# EAGLE design lvc (EAGLE 8.7.0)
DOC_NUM: 1; REVISION: A
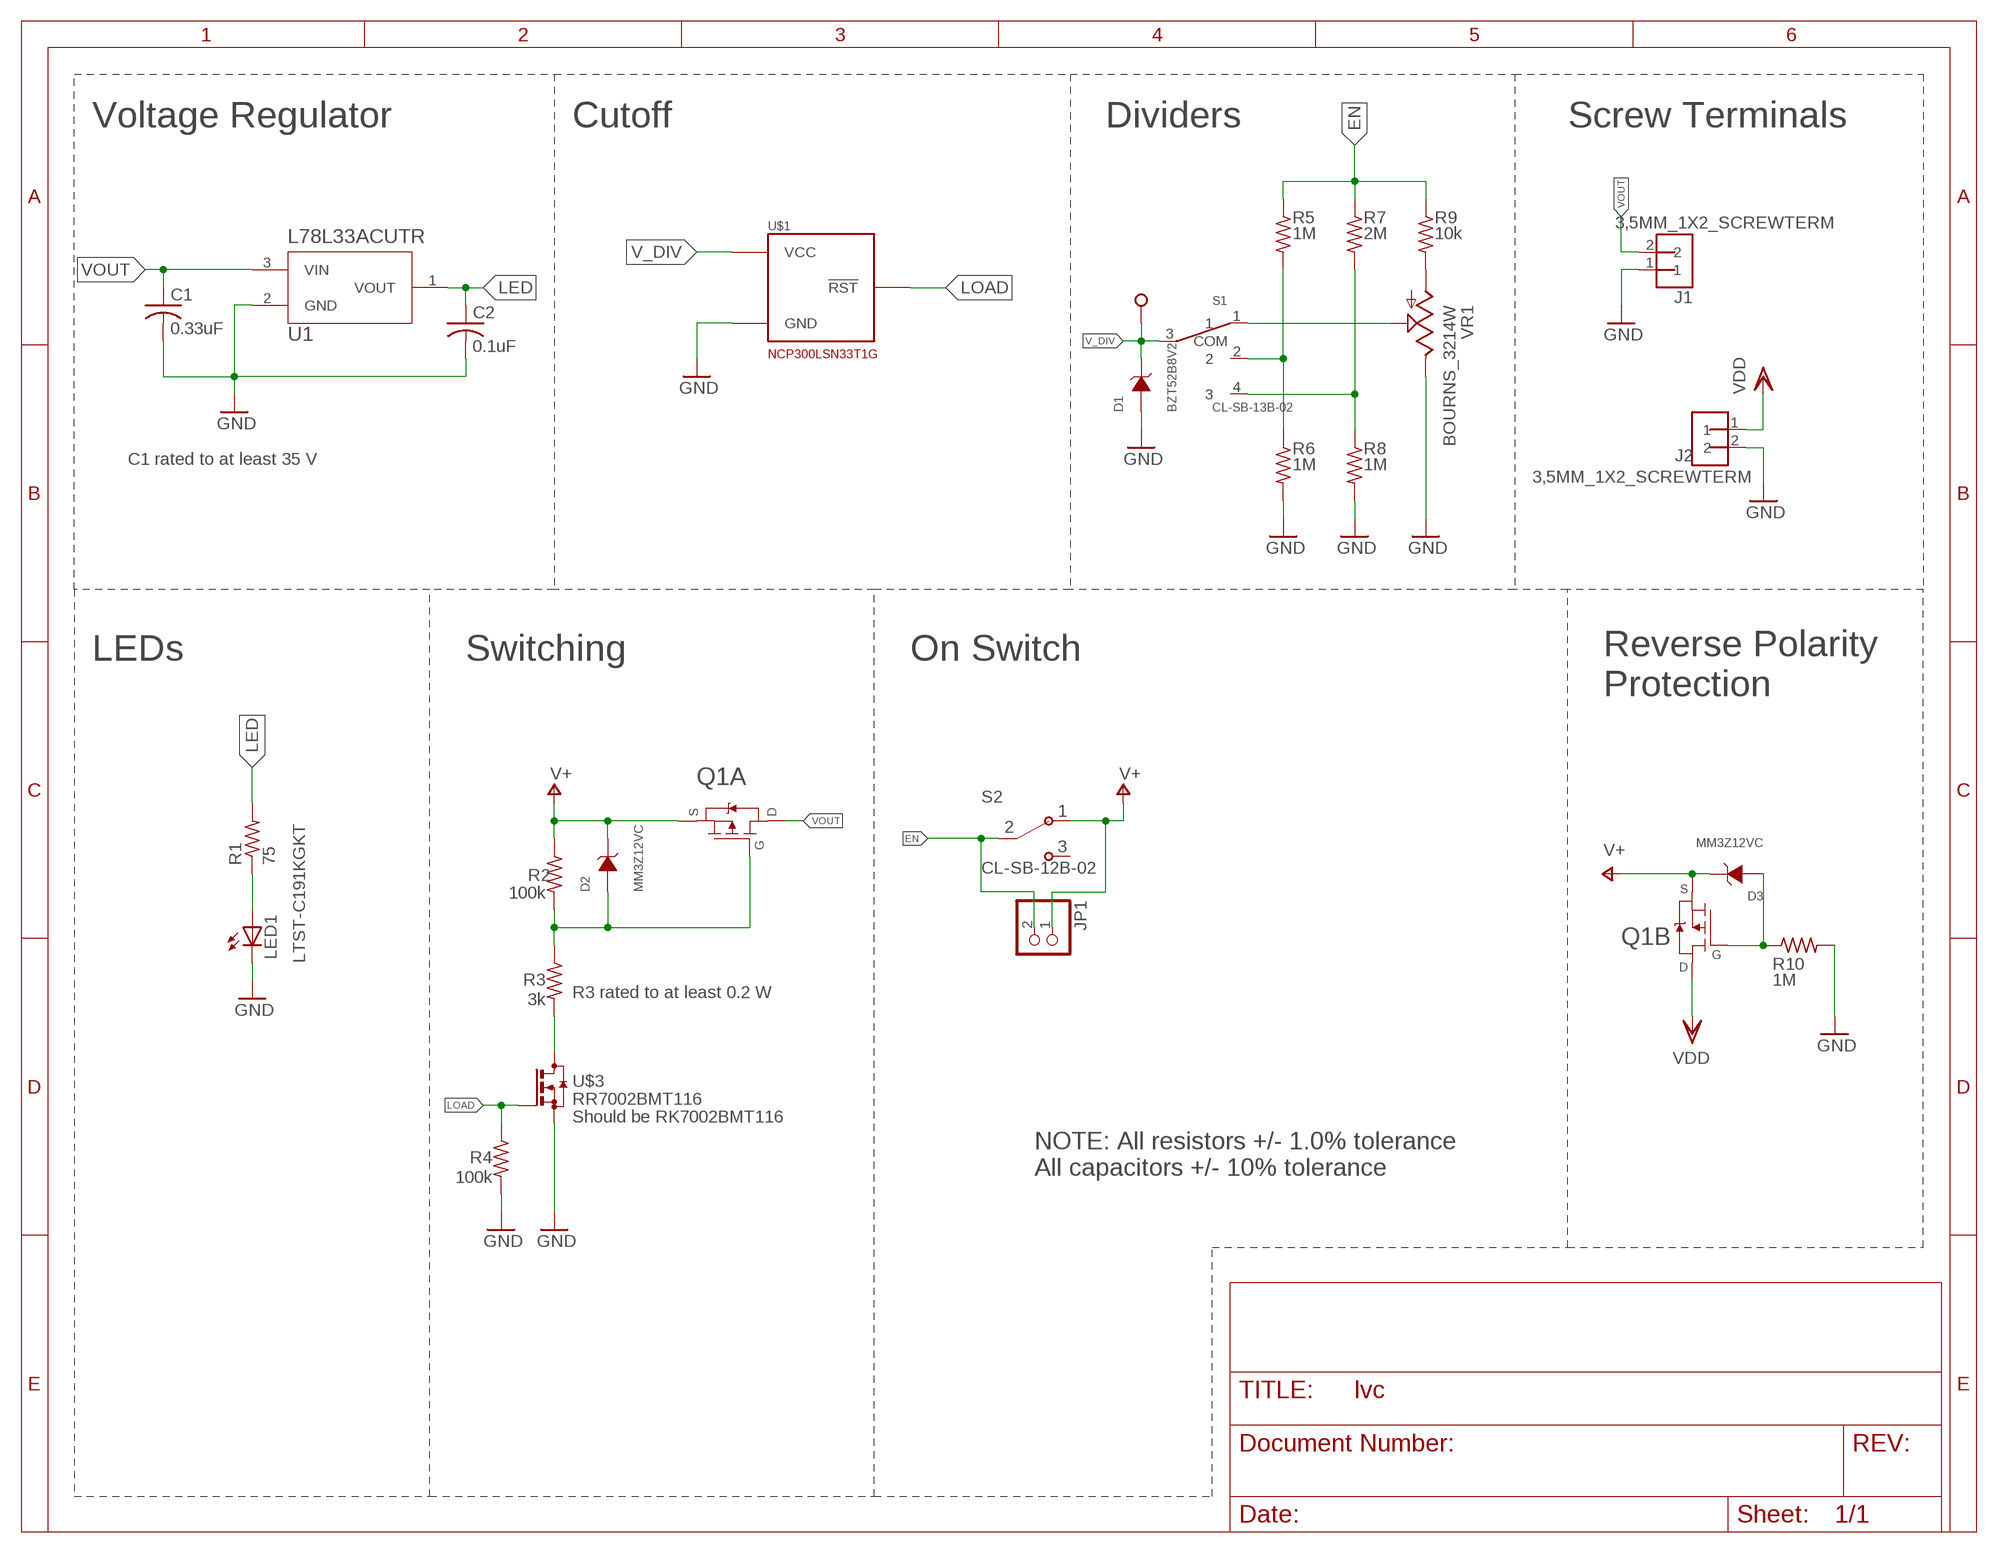
[diagram p0: schematic, sheet 1]

## Parts
C1  0.33uF  C-USC0603  [C0603]
C2  0.1uF  C-USC0603  [C0603]
D1  BZT52B8V2  [SOD123]
D2  MM3Z12VC  [SOD-323F]
D3  MM3Z12VC  [SOD-323F]
J1  3,5MM_1X2_SCREWTERM  [3.5MM_1X2]
J2  3,5MM_1X2_SCREWTERM  [3.5MM_1X2]
JP1  PINHD-1X2  [1X02]
LED1  LEDCHIPLED_0603  [CHIPLED_0603]
Q1  SI7997DP  [POWERPAK-SO-8-DUAL]
R1  75  R-US_R0603  [R0603]
R2  100k  R-US_R0603  [R0603]
R3  3k  R-US_R0603  [R0603]
R4  100k  R-US_R0603  [R0603]
R5  1M  R-US_R0603  [R0603]
R6  1M  R-US_R0603  [R0603]
R7  2M  R-US_R0603  [R0603]
R8  1M  R-US_R0603  [R0603]
R9  10k  R-US_R0603  [R0603]
R10  1M  R-US_R0603  [R0603]
S1  CL-SB-13B-02  [CL-SB-13B]
S2  CL-SB-12B-02  [CL-SB-12B]
TP1  TESTPOINT  [TP_2.5MM]
U1  L78L33ACUTR  [SOT-89]
U$1  NCP300LSN33T1G  [SOT23-5]
U$3  RR7002BMT116  [SOT23]
VR1  BOURNS_3214W  [J-LEAD_TOP_ADJ]

## Nets
2_CELL: R5.2 R6.1 S1.2
3_CELL: R7.2 R8.1 S1.4
EN: JP1.2 R5.1 R7.1 R9.1 S2.1
GND: C1.2 C2.2 D1.A J1.1 J2.2 LED1.C R4.2 R6.2 R8.2 R10.2 U1.2(GND) U$1.3(GND) U$3.2(S) VR1.3(E)
LED: C2.1 R1.2 U1.1(VOUT)
LOAD: R4.1 U$1.1(!RST!) U$3.1(G)
N$4: LED1.A R1.1
N$5: D2.1(A) Q1.4(A:G) R2.2 R3.1
N$6: D3.1(A) Q1.2(B:G) R10.1
N$7: R3.2 U$3.3(D)
N$8: S1.1 VR1.2(S)
N$11: R9.2 VR1.1(A)
V+: D2.2(C) D3.2(C) JP1.1 Q1.1(B:S) Q1.3(A:S) R2.1 S2.2
V_DIV: D1.C S1.3(COM) TP1.P$1 U$1.2(VCC)
VDD: J2.1 Q1.7(B:D) Q1.8(B:D) Q1.8L(B:D)
VOUT: C1.1 J1.2 Q1.5(A:D) Q1.5L(A:D) Q1.6(A:D) U1.3(VIN)
Unconnected: S2.3

## Notes on the sheet
- Voltage Regulator | Cutoff | Dividers | Screw Terminals
- C1 rated to at least 35 V
- LEDs | Switching | On Switch
- Reverse Polarity
  Protection
- LTST-C191KGKT
- R3 rated to at least 0.2 W
- Should be RK7002BMT116
- NOTE: All resistors +/- 1.0% tolerance
  All capacitors +/- 10% tolerance

## Library data of the parts
C1 C2 = rcl:C-US: CAPACITOR, American symbol; SPICEPREFIX: C
D1 = vishay1:BZT52B8V2
D2 D3 = NR_diode:MM3Z12VC
J1 J2 = NR_conn:3,5MM_1X2_SCREWTERM
JP1 = pinhead:PINHD-1X2: PIN HEADER
LED1 = led:LED: LED OSRAM: - CHIPLED LG R971, LG N971, LY N971, LG Q971, LY Q971, LO R971, LY R971 LH N974, LH R974 LS Q976, LO Q976, LY Q976 LO Q996 - Hyper CHIPLED LW Q18S LB Q993, LB Q99A, LB R99A - SideLED LS A670, LO A670, LY A670, LG A670, LP A670 LB A673, LV A673, LT A673, LW A673 LH A674 LY A675 LS A676, LA A676, LO A676, LY A676, LW A676 LS A679, LY A679, LG A679 - Hyper Micro SIDELED® LS Y876, LA Y876, LO Y876, LY Y876 LT Y87S - SmartLED LW L88C, LW L88S LB L89C, LB L89S, LG L890 LS L89K, LO L89K, LY L89K LS L896, LA L896, LO L896, LY L896 - TOPLED LS T670, LO T670, LY T670, LG T670, LP T670 LSG T670, LSP T670, LSY T670, LOP T670, LYG T670 LG T671, LOG T671, LSG T671 LB T673, LV T673, LT T673, LW T673 LH T674 LS T676, LA T676, LO T676, LY T676, LB T676, LH T676, LSB T676, LW T676 LB T67C, LV T67C, LT T67C, LS T67K, LO T67K, LY T67K, LW E67C LS E67B, LA E67B, LO E67B, LY E67B, LB E67C, LV E67C, LT E67C LW T67C LS T679, LY T679, LG T679 LS T770, LO T770, LY T770, LG T770, LP T770 LB T773, LV T773, LT T773, LW T773 LH T774 LS E675, LA E675, LY E675, LS T675 LS T776, LA T776, LO T776, LY T776, LB T776 LHGB T686 LT T68C, LB T68C - Hyper Mini TOPLED® LB M676 - Mini TOPLED Santana® LG M470 LS M47K, LO M47K, LY M47K Source: http://www.osram.convergy.de LUXEON: - LUMILED® LXK2-PW12-R00, LXK2-PW12-S00, LXK2-PW14-U00, LXK2-PW14-V00 LXK2-PM12-R00, LXK2-PM12-S00, LXK2-PM14-U00 LXK2-PE12-Q00, LXK2-PE12-R00, LXK2-PE12-S00, LXK2-PE14-T00, LXK2-PE14-U00 LXK2-PB12-K00, LXK2-PB12-L00, LXK2-PB12-M00, LXK2-PB14-N00, LXK2-PB14-P00, LXK2-PB14-Q00 LXK2-PR12-L00, LXK2-PR12-M00, LXK2-PR14-Q00, LXK2-PR14-R00 LXK2-PD12-Q00, LXK2-PD12-R00, LXK2-PD12-S00 LXK2-PH12-R00, LXK2-PH12-S00 LXK2-PL12-P00, LXK2-PL12-Q00, LXK2-PL12-R00 Source: www.luxeon.com KINGBRIGHT: KA-3528ASYC Source: www.kingbright.com
Q1 = AR_transistor:SI7997DP
R1 = rcl:R-US_: RESISTOR, American symbol; SPICEPREFIX: R
R2-R10 = resistor:R-US_: RESISTOR, American symbol
S1 = NR_switch:CL-SB-13B-02
S2 = AR_switches:CL-SB-12B-02
TP1 = CM_test:TESTPOINT
U1 = LR_vreg:L78L33ACUTR; MANUFACTURER_PART_NUMBER: L78L33ACUTR; VENDOR: STMicroelectronics
U$1 = onsemi:NCP300LSN33T1G
U$3 = rohm1:RR7002BMT116
VR1 = NR_pot:BOURNS_3214W

## Board
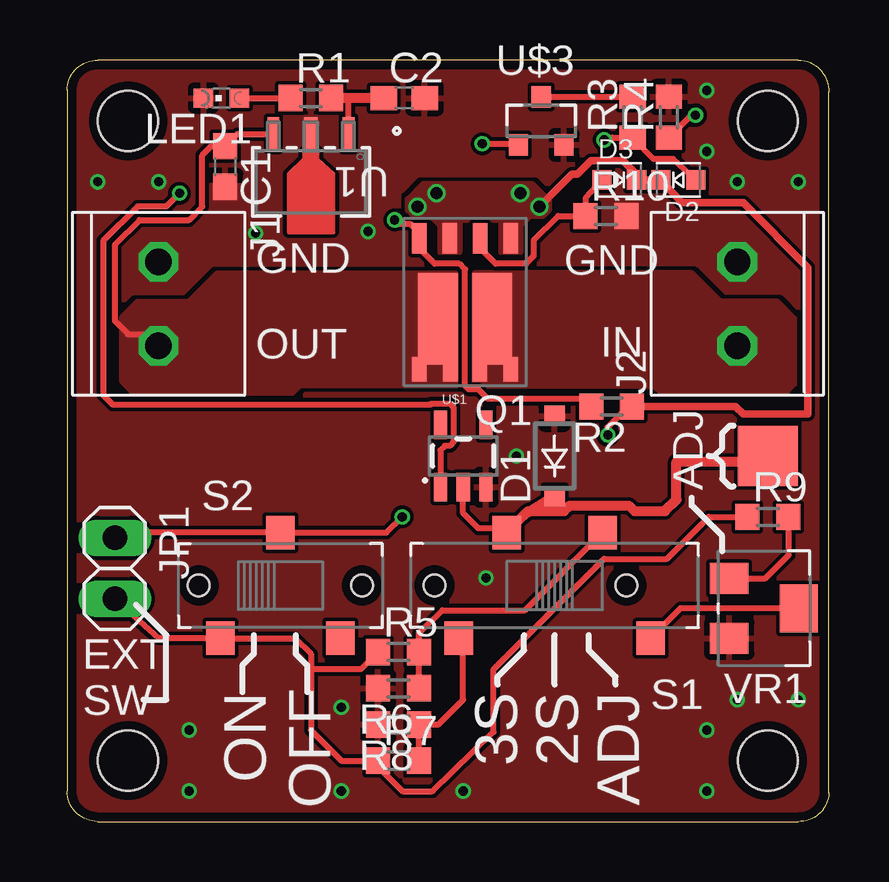
[diagram p1: board, top side]
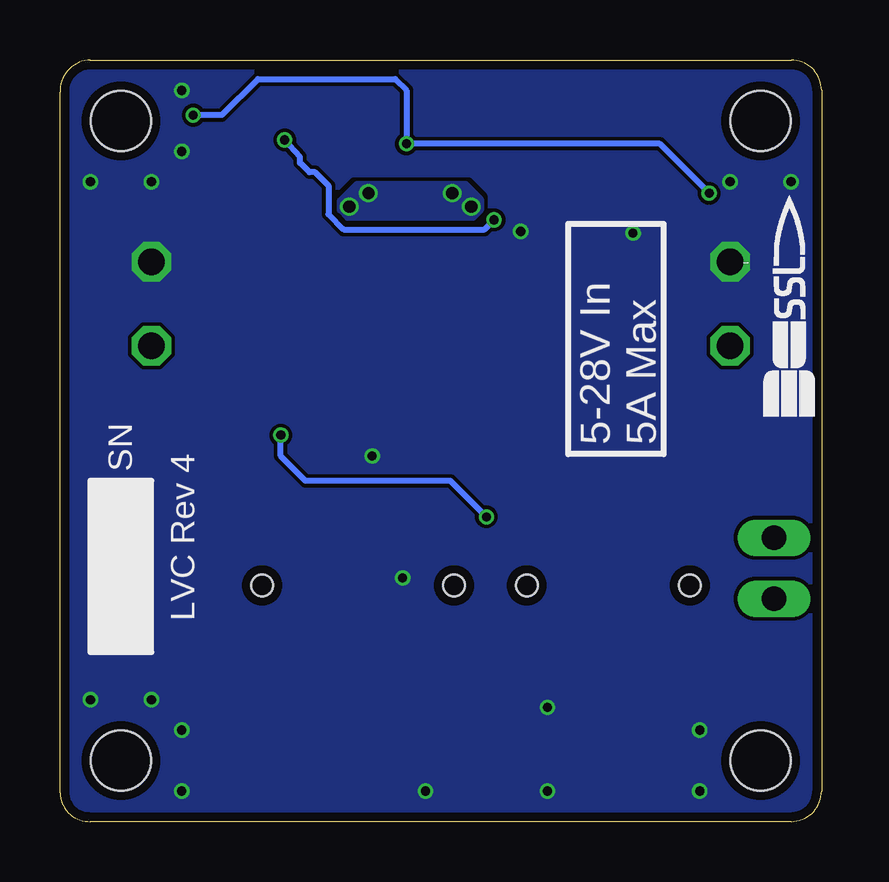
[diagram p2: board, bottom side, seen from below]

Size 31.75 x 31.75 mm. Coordinates in mm from the lower left corner, seen from the top.
Outline: 1.27,0 30.48,0 arc90 31.75,1.19 31.75,30.4 arc90 30.48,31.75 1.27,31.75 arc90 0,30.48 0,1.27 arc90 1.27,0
Copper layers (1*16): Top 0.035559375mm / dielectric 1.6mm / Bottom 0.035559375mm
Design rules "oshpark-2layer": minimum track width 6mil, minimum drill 10mil, track to track 6mil, track to pad 6mil, pad to pad 6mil, via to via 6mil, smd to smd 6mil, copper to edge 15mil, drill to drill 6mil, minimum pad ring 5mil, minimum via ring 5mil, stop-mask expansion 2.5mil, vias tented up to drill 0mil, thermal gap 10mil
Holes 2.5 mm at 2.54,29.21 29.21,29.21 29.21,2.54 2.54,2.54

### Footprints (pad centres in the part's own frame; a part is rotated, then mirrored left to right if it is on the bottom)
C0603 = smd 1.1 x 1: 1 -0.85,0; 2 0.85,0
SOD123 = smd 0.85 x 0.85: A 1.675,0; C -1.675,0
SOD-323F = smd 0.8 x 0.8: 1 -0.725,0; 2 0.725,0
3.5MM_1X2 = drill 1.1 octagon: 1 -1.75,0; 2 1.75,0
1X02 = drill 1.016 long: 1 -1.27,0; 2 1.27,0
CHIPLED_0603 = smd 0.8 x 0.8: A 0,-0.75; C 0,0.75
POWERPAK-SO-8-DUAL = smd 0.61 x 1.27: 1 -1.905,-2.725; 2 -0.635,-2.725; 3 0.635,-2.725; 4 1.905,-2.725 | smd 0.61 x 1.02: 5 1.905,2.74; 8 -1.905,2.74 | smd 1.65 x 3.81: 5L 1.13,0.635; 8L -1.13,0.635 | smd 0.61 x 0.71: 6 0.61,2.895; 7 -0.61,2.895
R0603 = smd 1 x 1.1: 1 -0.85,0; 2 0.85,0
CL-SB-13B = smd 1.2 x 1.4: 1 -4,2.2; 2 -2,-2.2; 3 2,-2.2; 4 4,2.2 | hole 0.9: -3,0; 5,0
CL-SB-12B = smd 1.2 x 1.4: 1 -2.5,-2.2; 2 0,2.2; 3 2.5,-2.2 | hole 0.9: -3.4,0; 3.4,0
TP_2.5MM = smd 2.5 x 2.5: P$1 0,0
SOT-89 = smd 0.483 x 1.397: 1 -1.57,-1.994; 3 1.57,-1.994 | smd 0.559 x 1.397: 2 0,-1.994
SOT23-5 = smd 0.55 x 1.2: 1 -0.95,-1.3; 2 0,-1.3; 3 0.95,-1.3; 4 0.95,1.3; 5 -0.95,1.3
SOT23 = smd 0.8 x 0.9: 1 -0.95,-1; 2 0.95,-1; 3 0,1
J-LEAD_TOP_ADJ = smd 1.6 x 1.3: 1 1.45,-1.25; 3 1.45,1.25 | smd 1.6 x 2: 2 -1.45,0

### Placement (x,y rotation side)
C1  6.59,27.3 270 top
C2  14.05,30.16 0 top
D1  20.32,15.24 90 top
D2  25.48,26.75 180 top
D3  23.02,26.75 0 top
J1  3.81,21.59 270 top
J2  27.94,21.59 90 top
JP1  1.98,10.56 270 top
LED1  6.43,30.16 90 top
Q1  16.59,21.59 180 top
R1  10.16,30.16 0 top
R2  22.7,17.3 180 top
R3  23.57,29.37 90 top
R4  25.08,29.37 90 top
R5  13.81,7.06 0 top
R6  13.81,5.56 180 top
R7  13.81,2.54 0 top
R8  13.81,4.05 180 top
R9  29.21,12.7 0 top
R10  22.46,25.24 0 top
S1  20.32,9.84 180 top
S2  8.89,9.84 0 top
TP1  29.21,15.24 0 top
U1  10.16,26.67 180 top
U$1  16.51,15.24 0 top
U$3  19.76,29.21 0 top
VR1  29.05,8.89 180 top

### Tracks (layer width: path | path; a pad name or v marks a point on that pad's centre or on a via)
2_CELL
  Top 0.254: R6.1 R5.2 14.66,7.83 15.64,8.81 19.09,8.81 S1.2
3_CELL
  Top 0.254: R7.2 R8.1 15.48,4.05 16.51,5.08 16.51,7.45 S1.4
EN
  Top 0.254: 10.16,6.35 10.16,6.99 9.5,7.64 S2.1 3.81,7.64 JP1.2 | 10.16,6.35 10.16,3.81 11.43,2.54 12.7,2.54 | R5.1 12.25,6.35 10.16,6.35 | 12.96,2.28 13.97,1.27 15.24,1.27 17.78,3.73 17.78,6.35 22.38,10.95 25,10.95 26.75,12.7 R9.1
  Top 0.406: 12.7,2.54 R7.1 12.96,2.28
GND  (via drill 0.38)
  other vias: 30.48,26.67 27.94,26.67 26.67,27.94 26.67,30.48 11.43,1.27 16.51,1.27 17.46,10.16 11.43,4.76 3.81,26.67 1.27,26.67 30.48,5.08 27.94,5.08 26.67,3.81 26.67,1.27 5.08,1.27 5.08,3.81 18.73,15.24 7.86,24.53 12.54,24.61
  pour Top (rank 3, no thermals): 29.37,22.15 25.48,22.15 23.73,23.89 18.65,23.89 17.86,24.69 13.26,24.69 10.48,21.91 2.54,21.91 2.54,25.08 3.97,26.51 8.89,26.51 8.97,29.37 11.51,29.37 11.43,26.51 24.05,26.51 26.04,24.53 29.21,24.53
  pour Bottom (rank 3, no thermals): 29.21,22.3 25.32,22.3 23.73,23.89 18.65,23.89 17.86,24.69 13.26,24.69 10.48,21.91 2.54,21.91 2.54,25.08 3.97,26.51 24.05,26.51 26.04,24.53 29.21,24.53
  pour Top (rank 6): -1.27,33.02 33.02,33.02 33.02,-1.27 -1.27,-1.27
  pour Bottom (rank 6): -2.54,34.29 34.29,34.29 34.29,-2.54 -2.54,-2.54
LED
  Top 0.254: U1.1 11.73,30.1 11.67,30.16
  Top 0.406: C2.1 11.67,30.16 R1.2
LOAD  (via drill 0.38)
  Top 0.254: v26.19,29.45 26.01,29.45 R4.1 25.08,28.89 | v17.3,28.26 18.77,28.26 U$3.1 | v4.68,26.19 4.13,25.64 2.94,25.64 1.51,24.21 1.51,17.78 1.91,17.38 15.13,17.38 15.17,17.42 15.95,17.42 16.11,17.26 16.11,15.82 15.95,15.66 15.74,15.66 15.56,15.48 U$1.1
  Bottom 0.254: v26.19,29.45 25,29.45 23.5,30.96 17.78,30.96 17.3,30.48 v17.3,28.26 6.75,28.26 v4.68,26.19
N$4
  Top 0.254: LED1.A R1.1
N$5  (via drill 0.38)
  Top 0.254: D2.1 25.25,27.62 24.45,27.62 23.57,28.5 R3.1 22.72,28.52 v22.38,28.42 | R2.2 21.53,17.62 17.54,17.62 17.14,18.02 16.75,18.02 16.59,18.18 16.59,23.02 16.35,23.26 15.32,23.26 14.68,23.89 Q1.4 14.68,24.53 14.29,24.92 13.81,24.92 v13.65,25.08
  Bottom 0.254: v13.65,25.08 14.05,24.69 19.92,24.69 20.56,25.32 20.56,26.51 21.11,27.07 21.35,27.07 21.75,27.46 21.75,27.7 v22.38,28.42
N$6
  Top 0.254: Q1.2 17.22,23.89 17.86,23.26 19.13,23.26 19.45,23.57 19.45,24.21 20.48,25.24 R10.1 21.61,25.99 D3.1
N$7
  Top 0.254: U$3.3 R3.2
N$8
  Top 0.254: VR1.2 25.57,8.89 S1.1
N$11
  Top 0.254: VR1.1 29.11,10.14 30.08,11.11 30.08,12.68 R9.2
V+  (via drill 0.38, 0.51)
  Top 0.254: v22.54,16.11 22.52,16.14 22.52,16.43 23.39,17.3 | v13.97,12.7 13.31,12.04 S2.2 3.07,12.04 JP1.1
  Top 0.305: v19.68,25.64 21.03,26.99 21.27,26.99 21.83,27.54 23.18,27.54 23.97,26.75 | R2.1 27.86,17.3 28.18,16.99 30.88,16.99 30.88,23.1 28.18,25.8 25.63,25.8 D2.2 23.97,26.75 | 23.97,26.75 D3.2
  Top 0.406: 23.39,17.3 R2.1
  Bottom 0.254: v22.54,16.11 22.54,15.24 21.51,14.21 15.48,14.21 v13.97,12.7
  other vias: 15.4,26.19 14.61,25.64 18.89,26.19
  pour Top (no thermals): 16.35,23.73 15.56,23.73 15.56,24.84 15.16,25.24 14.45,25.24 14.21,25.48 14.21,25.96 14.84,26.59 19.37,26.59 20.08,25.88 20.08,25.48 19.84,25.24 19.29,25.24 18.89,24.84 18.89,23.73 18.1,23.73 18.1,25.08 16.35,25.08
  pour Bottom: 14.21,25.48 14.53,25.16 19.76,25.16 20.08,25.48 20.08,25.88 19.37,26.59 14.84,26.59 14.21,25.96
V_DIV
  Top 0.254: S1.3 18.14,12.22 17.14,12.22 16.51,12.86 U$1.2
  Top 0.406: S1.3 19.05,12.77 | 19.05,12.77 19.22,12.94 20.72,12.94 20.95,13.18 23.42,13.18 23.65,12.94 24.92,12.94 25.4,13.41 25.4,15.01 28.98,15.01 TP1.P$1 | D1.C 19.05,12.77
VDD
  pour Top (no thermals): 30.32,20.95 29.61,21.67 27.23,21.67 26.04,22.86 16.99,22.86 16.99,18.18 24.45,18.18 24.77,17.86 30,17.94 30.32,18.26
VOUT
  Top 0.254: J1.2 3.81,20.32 2.54,20.32 1.98,20.88 1.98,24.05 3.02,25.08 5.08,25.08 5.64,25.64 5.64,27.78 6.01,28.16 C1.1 7.1,28.66 U1.3
  pour Top (no thermals): 2.3,21.03 2.94,21.67 5.08,21.67 6.27,22.86 16.19,22.86 16.19,18.18 9.68,18.18 9.37,17.86 2.78,17.86 2.3,18.34

### Text on the board
tPlace: GND | GND | OUT | IN | ADJ | OFF | ON | 3S | 2S | ADJ | EXT / SW
bPlace: 5-28V In / 5A Max | LVC Rev 4 | SN
Document: 2oz Copper / FR-4 or 408 / 1.0±0.1 Via plate thickness